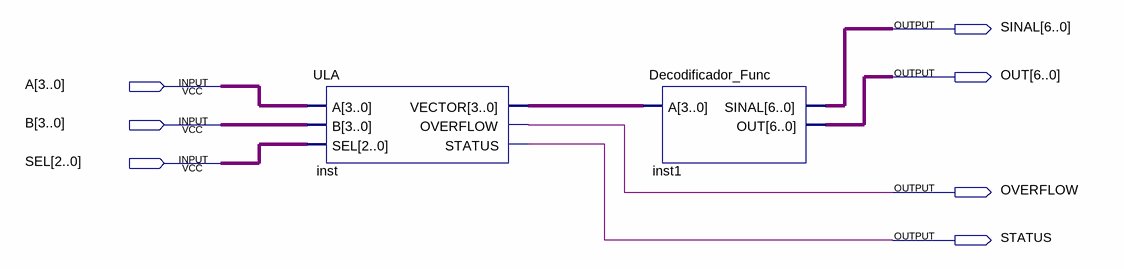
[diagram p0: schematic sheet]
// Quartus schematic ULA_Final.bdf as structural Verilog: 2 symbols, 7 pins
module ULA_Final (
  input  [3:0] A,
  input  [3:0] B,
  input  [2:0] SEL,
  output [6:0] SINAL,
  output [6:0] OUT,
  output OVERFLOW,
  output STATUS
);

  wire [3:0] inst_vector;

  ULA inst (.A(A), .B(B), .SEL(SEL), .VECTOR(inst_vector), .OVERFLOW(OVERFLOW), .STATUS(STATUS));
  Decodificador_Func inst1 (.A(inst_vector), .SINAL(SINAL), .OUT(OUT));
endmodule
